# EAGLE schematic Pin-with-a-screen-3v3 (EAGLE 7.6.0)
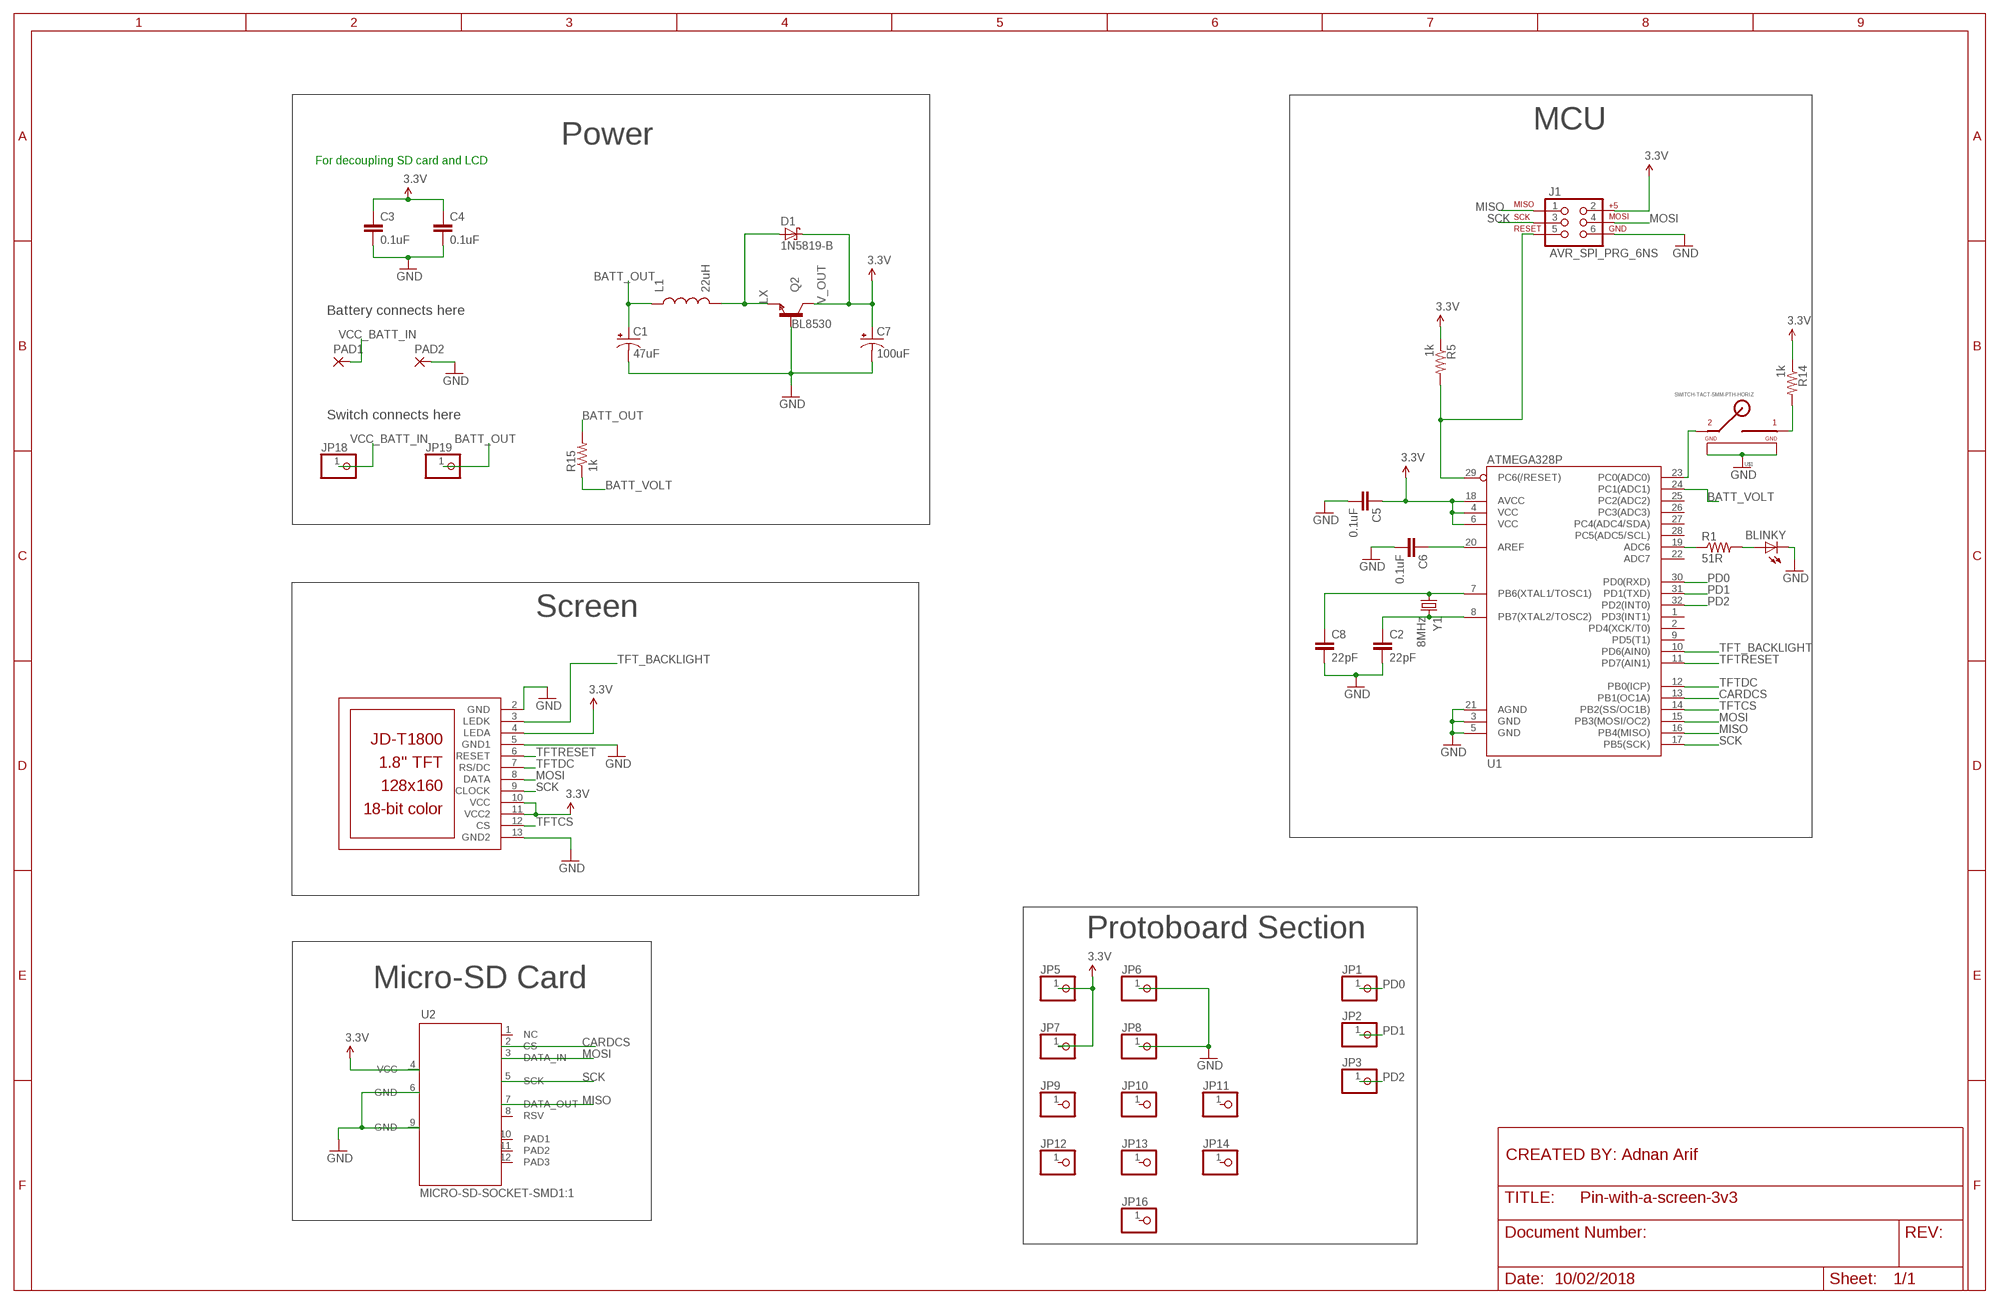
[diagram p0: schematic, sheet 1]
FRAME1 (FRAME_B_L): DATE: 10th Feb 2018

## Parts
BLINKY  Red  LED0603  [LED-0603]
C1  47uF  CAP_POL3528-KIT  [EIA3528-KIT]
C2  22pF  CAP0603-CAP  [0603-CAP]
C3  0.1uF  CAP0603-CAP  [0603-CAP]
C4  0.1uF  CAP0603-CAP  [0603-CAP]
C5  0.1uF  CAP0603-CAP  [0603-CAP]
C6  0.1uF  CAP0603-CAP  [0603-CAP]
C7  100uF  CAP_POL3528-KIT  [EIA3528-KIT]
C8  22pF  CAP0603-CAP  [0603-CAP]
D1  1N5819-B  [DO41-7.6]
J1  AVR_SPI_PRG_6NS  [2X3-NS]
JP1  PINHD-1X1  [1X01]
JP2  PINHD-1X1  [1X01]
JP3  PINHD-1X1  [1X01]
JP5  PINHD-1X1  [1X01]
JP6  PINHD-1X1  [1X01]
JP7  PINHD-1X1  [1X01]
JP8  PINHD-1X1  [1X01]
JP9  PINHD-1X1  [1X01]
JP10  PINHD-1X1  [1X01]
JP11  PINHD-1X1  [1X01]
JP12  PINHD-1X1  [1X01]
JP13  PINHD-1X1  [1X01]
JP14  PINHD-1X1  [1X01]
JP16  PINHD-1X1  [1X01]
JP18  PINHD-1X1  [1X01]
JP19  PINHD-1X1  [1X01]
L1  22uH  INDUCTOR0603  [0603]
LCD2  JD-T1800  [JD-T1800]
PAD1  2,15/1,0  [2,15/1,0]
PAD2  2,15/1,0  [2,15/1,0]
Q2  BL8530  TRANSISTOR_NPNSOT89  [SOT89]
R1  51R  RESISTOR0603-RES  [0603-RES]
R5  1k  RESISTOR0603-RES  [0603-RES]
R14  1k  RESISTOR0603-RES  [0603-RES]
R15  1k  RESISTOR0603-RES  [0603-RES]
U1  ATMEGA328P  ATMEGA328_SMT  [TQFP32-08]
U2  MICRO-SD-SOCKET-SMD1:1  [MICRO-SD-SOCKET-SMD-1:1]
U$1  SWITCH-TACT-5MM-PTH-HORIZ  [5MM-PTH]
Y1  8MHz  CRYSTALSMD  [HC49UP]

## Nets
3.3V: C3.1 C4.1 C5.1 C7.A(+) D1.C J1.2 JP5.1 JP7.1 LCD2.4(LEDA) LCD2.10(VCC) LCD2.11(VCC2) Q2.2(C) R5.1 R14.1 U1.4(VCC) U1.6(VCC) U1.18(AVCC) U2.4(VCC)
BATT_OUT: C1.A(+) JP19.1 L1.1 R15.2
BATT_VOLT: R15.1 U1.24(PC1(ADC1))
CARDCS: U1.13(PB1(OC1A)) U2.2(CS)
GND: BLINKY.C C1.C(-) C2.2 C3.2 C4.2 C5.2 C6.2 C7.C(-) C8.2 J1.6 JP6.1 JP8.1 LCD2.2(GND) LCD2.5(GND1) LCD2.13(GND2) PAD2.1(P) Q2.1(B) U1.3(GND) U1.5(GND) U1.21(AGND) U2.6(GND) U2.9(GND) U$1.GND U$1.GND1
LX: D1.A L1.2 Q2.3(E)
MISO: J1.1 U1.16(PB4(MISO)) U2.7(DATA_OUT)
MOSI: J1.4 LCD2.8(DATA) U1.15(PB3(MOSI/OC2)) U2.3(DATA_IN)
N$1: U1.23(PC0(ADC0)) U$1.2
N$2: R14.2 U$1.1
N$3: C6.1 U1.20(AREF)
N$4: C8.1 U1.7(PB6(XTAL1/TOSC1)) Y1.1
N$5: C2.1 U1.8(PB7(XTAL2/TOSC2)) Y1.2
N$6: J1.5 R5.2 U1.29(PC6(/RESET))
N$7: R1.1 U1.19(ADC6)
N$8: BLINKY.A R1.2
PD0: JP1.1 U1.30(PD0(RXD))
PD1: JP2.1 U1.31(PD1(TXD))
PD2: JP3.1 U1.32(PD2(INT0))
SCK: J1.3 LCD2.9(CLOCK) U1.17(PB5(SCK)) U2.5(SCK)
TFT_BACKLIGHT: LCD2.3(LEDK) U1.10(PD6(AIN0))
TFTCS: LCD2.12(CS) U1.14(PB2(SS/OC1B))
TFTDC: LCD2.7(RS/DC) U1.12(PB0(ICP))
TFTRESET: LCD2.6(RESET) U1.11(PD7(AIN1))
VCC_BATT_IN: JP18.1 PAD1.1(P)
Unconnected: JP9.1 JP10.1 JP11.1 JP12.1 JP13.1 JP14.1 JP16.1 U1.1(PD3(INT1)) U1.2(PD4(XCK/T0)) U1.9(PD5(T1)) U1.22(ADC7) U1.25(PC2(ADC2)) U1.26(PC3(ADC3)) U1.27(PC4(ADC4/SDA)) U1.28(PC5(ADC5/SCL)) U2.1(NC) U2.8(RSV) U2.10(PAD1) U2.11(PAD2) U2.12(PAD3)

## Notes on the sheet
- MCU
- Power
- For decoupling SD card and LCD
- V_OUT
- Battery connects here
- Switch connects here
- Screen
- Protoboard Section
- Micro-SD Card
- CREATED BY: Adnan Arif
- 10/02/2018

## Library data of the parts
BLINKY = SparkFun:LED: LEDs Standard schematic elements and footprints for 5mm, 3mm, 1206, and 0603 sized LEDs. 5mm - Spark Fun Electronics SKU : COM-00529 (and others)
C1 C7 = SparkFun-Capacitors:CAP_POL: Capacitor Polarized These are standard SMD and PTH capacitors. Normally 10uF, 47uF, and 100uF in electrolytic and tantalum varieties. Always verify the external diameter of the through hole cap, it varies with capacity, voltage, and manufacturer. The EIA devices should be standard.
C2-C6 C8 = SparkFun:CAP: Capacitor Standard 0603 ceramic capacitor, and 0.1" leaded capacitor.
D1 = diode:1N581*: 1.0A SCHOTTKY BARRIER RECTIFIER Source: http://www.diodes.com/datasheets/ds23001.pdf
J1 = SparkFun-Connectors:AVR_SPI_PRG_6: AVR ISP 6 Pin This is the reduced ISP connector for AVR programming. Common on Arduino. This footprint will take up less PCB space and can be used with a 10-pin to 6-pin adapter such as SKU: BOB-08508
JP1-JP3 JP5-JP14 JP16 JP18 JP19 = pinhead:PINHD-1X1: PIN HEADER
L1 = SparkFun:INDUCTOR: Inductors Basic Inductor/Choke - 0603 and 1206. Footprints are not proven and vary greatly between part numbers.
LCD2 = adafruit:JD-T1800
PAD1 PAD2 = wirepad:2,15/1,0: THROUGH-HOLE PAD
Q2 = SparkFun:TRANSISTOR_NPN: Transistor NPN BJT configuration in SOT23 package. MMBT2222 is the common NPN we use. Double check BCE configuration again layout.
R1 R5 R14 R15 = SparkFun-Passives:RESISTOR: Resistor Basic schematic elements and footprints for 0603, 1206, and PTH resistors.
U1 = SparkFun-DigitalIC:ATMEGA328_SMT: 32-Pin Atmega328 part Commonly used on Arduino compatible boards Available in QFP and QFN packages TQFP is IC-09069 QFN is non-stock; PROD_ID: IC-09069
U2 = SD-library-Adnan:MICRO-SD-SOCKET-SMD: This footprint was created for a Transflash TF micro SD card socket purchased from eBay in Feb 2018. Link (could break over time): https://www.ebay.com/itm/171297065693?ViewItem=&item=171297065693
U$1 = switches_adnan:SWITCH-TACT-5MM-PTH-HORIZ: Horizontal (right-angle) momentary tactile switch from eBay. 6*6*5mm
Y1 = SparkFun-FreqCtrl:CRYSTAL: Various standard crystals. Proven footprints. Spark Fun Electronics SKU : COM-00534